# EAGLE schematic PotDivMUXwithOP v9 (EAGLE 9.7.0)
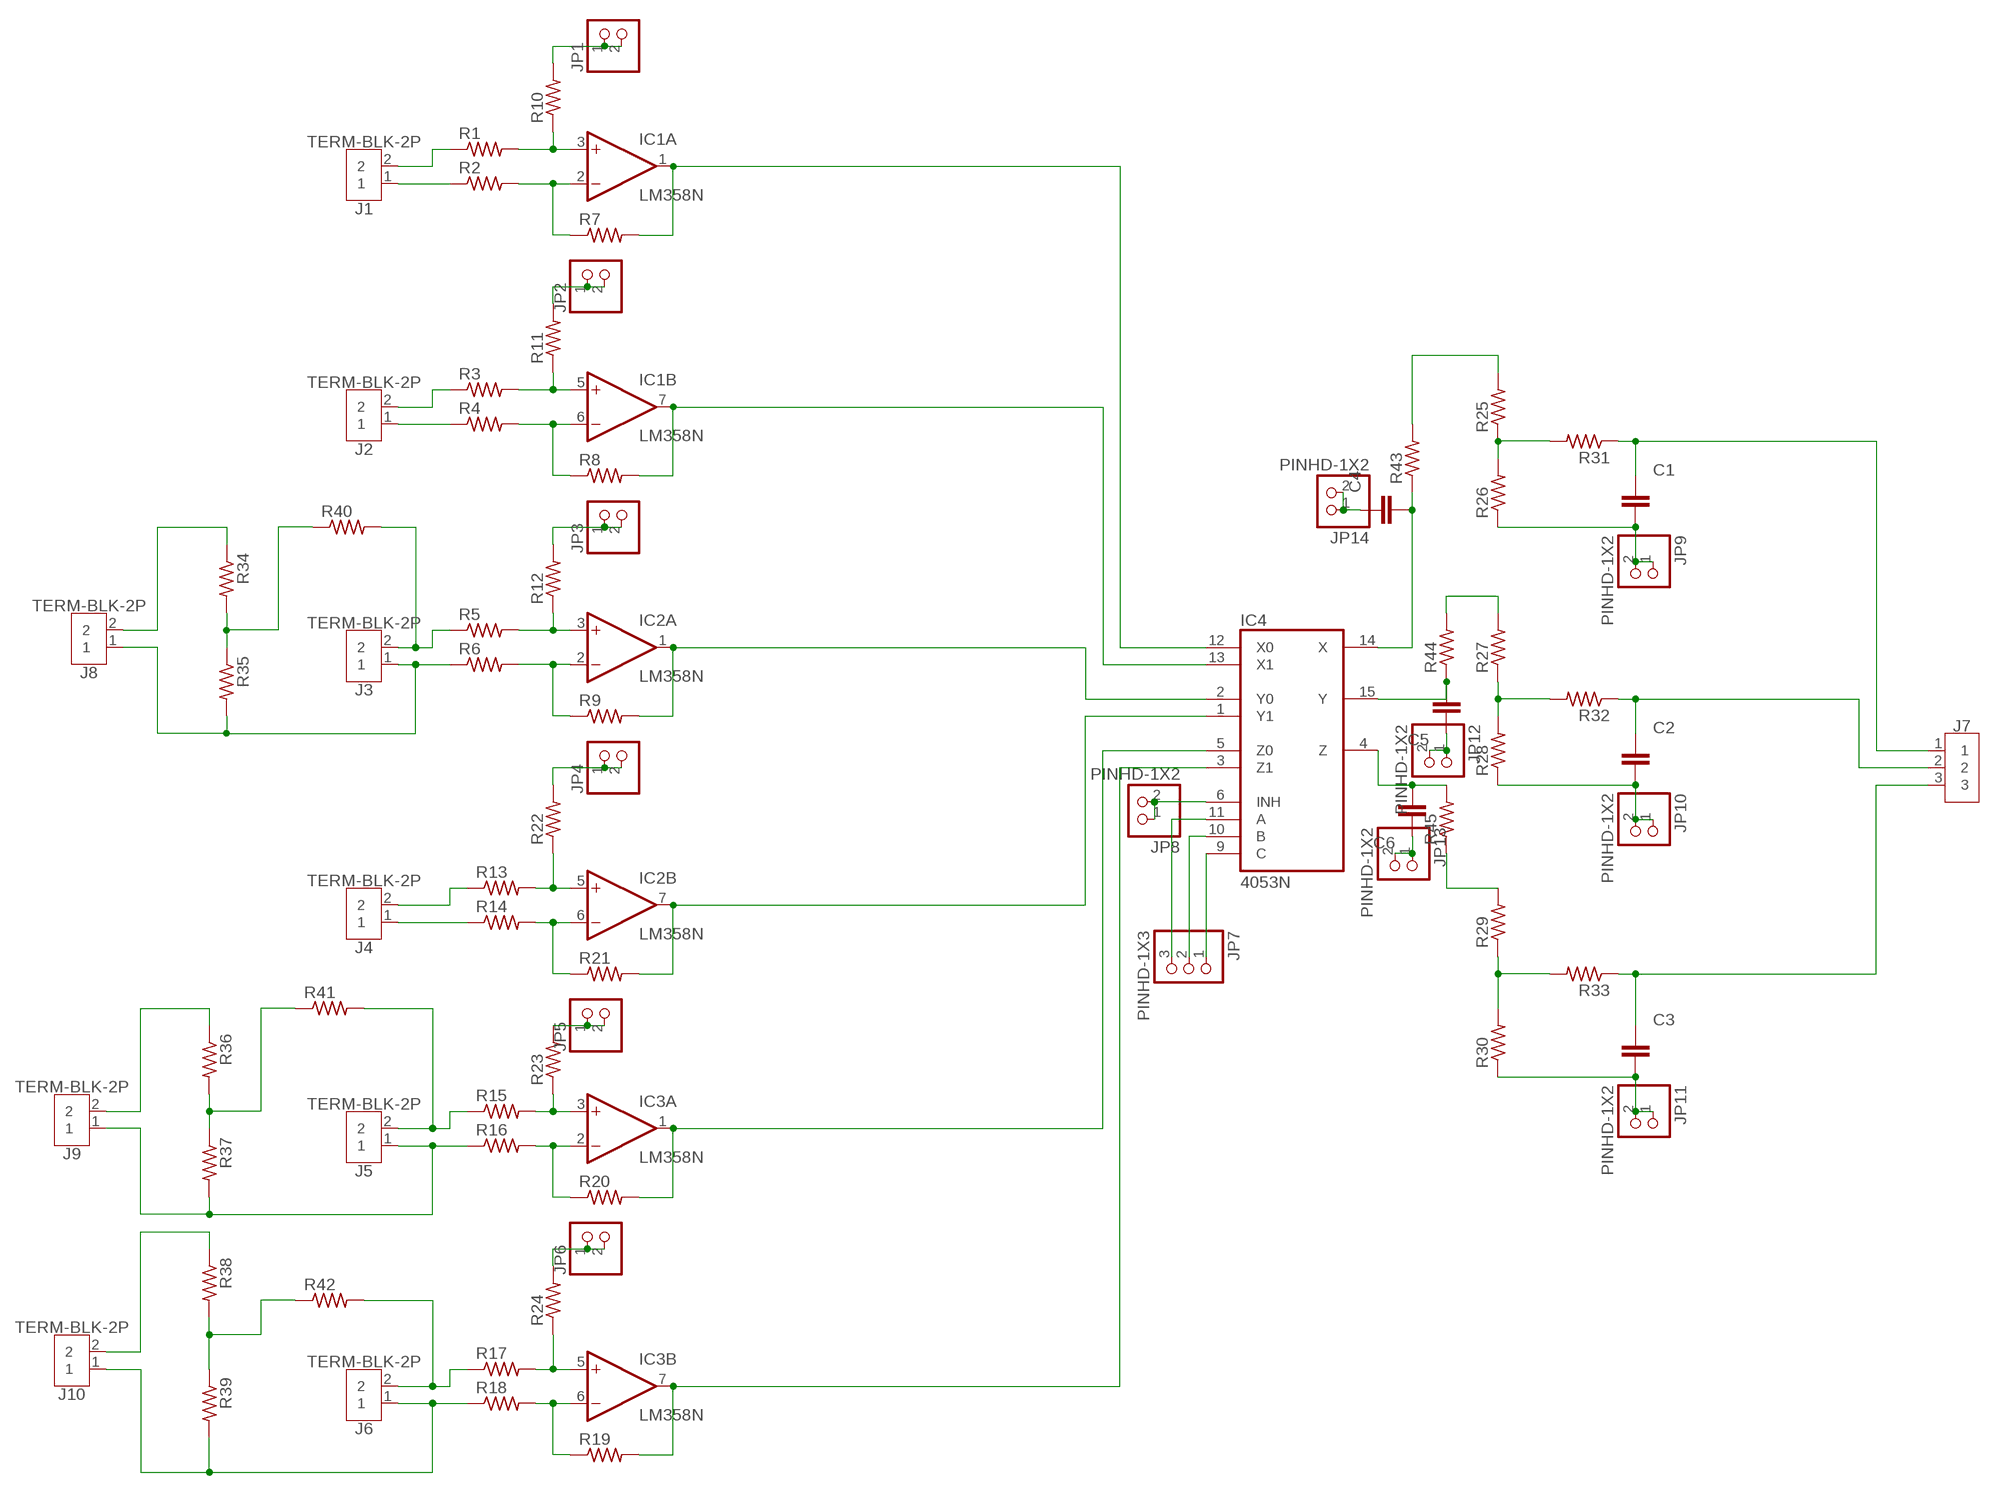
[diagram p0: schematic, sheet 1]

## Parts
C1  C_RADIAL-12.5MM-DIA  [CAPRD550W60D1025H1250B]
C2  C_RADIAL-12.5MM-DIA  [CAPRD550W60D1025H1250B]
C3  C_RADIAL-12.5MM-DIA  [CAPRD550W60D1025H1250B]
C4  C_RADIAL-12.5MM-DIA  [CAPRD550W60D1025H1250B]
C5  C_RADIAL-12.5MM-DIA  [CAPRD550W60D1025H1250B]
C6  C_RADIAL-12.5MM-DIA  [CAPRD550W60D1025H1250B]
IC1  LM358N  [DIL08]
IC2  LM358N  [DIL08]
IC3  LM358N  [DIL08]
IC4  4053N  [DIL16]
J1  TERM-BLK-2P  2828XX-2282837-2  [TERMBLK_508-2N]
J2  TERM-BLK-2P  2828XX-2282837-2  [TERMBLK_508-2N]
J3  TERM-BLK-2P  2828XX-2282837-2  [TERMBLK_508-2N]
J4  TERM-BLK-2P  2828XX-2282837-2  [TERMBLK_508-2N]
J5  TERM-BLK-2P  2828XX-2282837-2  [TERMBLK_508-2N]
J6  TERM-BLK-2P  2828XX-2282837-2  [TERMBLK_508-2N]
J7  TERM-BLK-3P  2828XX-3282837-3  [TERMBLK_508-3N]
J8  TERM-BLK-2P  2828XX-2282837-2  [TERMBLK_508-2N]
J9  TERM-BLK-2P  2828XX-2282837-2  [TERMBLK_508-2N]
J10  TERM-BLK-2P  2828XX-2282837-2  [TERMBLK_508-2N]
JP1  PINHD-1X2  [1X02]
JP2  PINHD-1X2  [1X02]
JP3  PINHD-1X2  [1X02]
JP4  PINHD-1X2  [1X02]
JP5  PINHD-1X2  [1X02]
JP6  PINHD-1X2  [1X02]
JP7  PINHD-1X3  [1X03]
JP8  PINHD-1X2  [1X02]
JP9  PINHD-1X2  [1X02]
JP10  PINHD-1X2  [1X02]
JP11  PINHD-1X2  [1X02]
JP12  PINHD-1X2  [1X02]
JP13  PINHD-1X2  [1X02]
JP14  PINHD-1X2  [1X02]
R1  R-US_AXIAL-7.2MM-PITCH  [RESAD724W46L381D178B]
R2  R-US_AXIAL-7.2MM-PITCH  [RESAD724W46L381D178B]
R3  R-US_AXIAL-7.2MM-PITCH  [RESAD724W46L381D178B]
R4  R-US_AXIAL-7.2MM-PITCH  [RESAD724W46L381D178B]
R5  R-US_AXIAL-7.2MM-PITCH  [RESAD724W46L381D178B]
R6  R-US_AXIAL-7.2MM-PITCH  [RESAD724W46L381D178B]
R7  R-US_AXIAL-7.2MM-PITCH  [RESAD724W46L381D178B]
R8  R-US_AXIAL-7.2MM-PITCH  [RESAD724W46L381D178B]
R9  R-US_AXIAL-7.2MM-PITCH  [RESAD724W46L381D178B]
R10  R-US_AXIAL-7.2MM-PITCH  [RESAD724W46L381D178B]
R11  R-US_AXIAL-7.2MM-PITCH  [RESAD724W46L381D178B]
R12  R-US_AXIAL-7.2MM-PITCH  [RESAD724W46L381D178B]
R13  R-US_AXIAL-7.2MM-PITCH  [RESAD724W46L381D178B]
R14  R-US_AXIAL-7.2MM-PITCH  [RESAD724W46L381D178B]
R15  R-US_AXIAL-7.2MM-PITCH  [RESAD724W46L381D178B]
R16  R-US_AXIAL-7.2MM-PITCH  [RESAD724W46L381D178B]
R17  R-US_AXIAL-7.2MM-PITCH  [RESAD724W46L381D178B]
R18  R-US_AXIAL-7.2MM-PITCH  [RESAD724W46L381D178B]
R19  R-US_AXIAL-7.2MM-PITCH  [RESAD724W46L381D178B]
R20  R-US_AXIAL-7.2MM-PITCH  [RESAD724W46L381D178B]
R21  R-US_AXIAL-7.2MM-PITCH  [RESAD724W46L381D178B]
R22  R-US_AXIAL-7.2MM-PITCH  [RESAD724W46L381D178B]
R23  R-US_AXIAL-7.2MM-PITCH  [RESAD724W46L381D178B]
R24  R-US_AXIAL-7.2MM-PITCH  [RESAD724W46L381D178B]
R25  R-US_AXIAL-7.2MM-PITCH  [RESAD724W46L381D178B]
R26  R-US_AXIAL-7.2MM-PITCH  [RESAD724W46L381D178B]
R27  R-US_AXIAL-7.2MM-PITCH  [RESAD724W46L381D178B]
R28  R-US_AXIAL-7.2MM-PITCH  [RESAD724W46L381D178B]
R29  R-US_AXIAL-7.2MM-PITCH  [RESAD724W46L381D178B]
R30  R-US_AXIAL-7.2MM-PITCH  [RESAD724W46L381D178B]
R31  R-US_AXIAL-7.2MM-PITCH  [RESAD724W46L381D178B]
R32  R-US_AXIAL-7.2MM-PITCH  [RESAD724W46L381D178B]
R33  R-US_AXIAL-7.2MM-PITCH  [RESAD724W46L381D178B]
R34  R-US_AXIAL-7.2MM-PITCH  [RESAD724W46L381D178B]
R35  R-US_AXIAL-7.2MM-PITCH  [RESAD724W46L381D178B]
R36  R-US_AXIAL-7.2MM-PITCH  [RESAD724W46L381D178B]
R37  R-US_AXIAL-7.2MM-PITCH  [RESAD724W46L381D178B]
R38  R-US_AXIAL-7.2MM-PITCH  [RESAD724W46L381D178B]
R39  R-US_AXIAL-7.2MM-PITCH  [RESAD724W46L381D178B]
R40  R-US_AXIAL-7.2MM-PITCH  [RESAD724W46L381D178B]
R41  R-US_AXIAL-7.2MM-PITCH  [RESAD724W46L381D178B]
R42  R-US_AXIAL-7.2MM-PITCH  [RESAD724W46L381D178B]
R43  R-US_AXIAL-7.2MM-PITCH  [RESAD724W46L381D178B]
R44  R-US_AXIAL-7.2MM-PITCH  [RESAD724W46L381D178B]
R45  R-US_AXIAL-7.2MM-PITCH  [RESAD724W46L381D178B]

## Nets
N$1: J1.1 R2.1
N$2: J1.2 R1.1
N$3: IC1.3(A:+IN) R1.2 R10.1
N$4: IC1.2(A:-IN) R2.2 R7.1
N$5: IC1.1(A:OUT) IC4.12(X0) R7.2
N$6: JP1.1 JP1.2 R10.2
N$7: J2.2 R3.1
N$8: J2.1 R4.1
N$9: IC1.5(B:+IN) R3.2 R11.1
N$10: IC1.6(B:-IN) R4.2 R8.1
N$11: JP2.1 JP2.2 R11.2
N$12: IC1.7(B:OUT) IC4.13(X1) R8.2
N$13: J3.1 J8.1 R6.1 R35.2
N$14: J3.2 R5.1 R40.2
N$15: IC2.3(A:+IN) R5.2 R12.1
N$16: JP3.1 JP3.2 R12.2
N$17: IC2.2(A:-IN) R6.2 R9.1
N$18: IC2.1(A:OUT) IC4.2(Y0) R9.2
N$19: J4.1 R14.1
N$20: J4.2 R13.1
N$21: IC2.5(B:+IN) R13.2 R22.1
N$22: IC2.6(B:-IN) R14.2 R21.1
N$23: JP4.1 JP4.2 R22.2
N$24: IC2.7(B:OUT) IC4.1(Y1) R21.2
N$25: J5.2 R15.1 R41.2
N$26: J5.1 J9.1 R16.1 R37.2
N$27: IC3.2(A:-IN) R16.2 R20.1
N$28: IC3.3(A:+IN) R15.2 R23.1
N$29: JP5.1 JP5.2 R23.2
N$30: IC3.1(A:OUT) IC4.5(Z0) R20.2
N$31: J6.1 J10.1 R18.1 R39.2
N$32: J6.2 R17.1 R42.2
N$33: IC3.5(B:+IN) R17.2 R24.1
N$34: JP6.1 JP6.2 R24.2
N$35: IC3.6(B:-IN) R18.2 R19.1
N$36: IC3.7(B:OUT) IC4.3(Z1) R19.2
N$37: IC4.6(INH) JP8.1 JP8.2
N$38: IC4.11(A) JP7.3
N$39: IC4.10(B) JP7.2
N$40: IC4.9(C) JP7.1
N$41: C4.2 IC4.14(X) R43.1
N$42: R25.1 R26.2 R31.2
N$43: C1.2 JP9.1 JP9.2 R26.1
N$44: C1.1 J7.1 R31.1
N$45: R27.2 R44.2
N$46: R27.1 R28.2 R32.2
N$47: C2.1 J7.2 R32.1
N$48: C2.2 JP10.1 JP10.2 R28.1
N$49: C6.2 IC4.4(Z) R45.2
N$50: R29.1 R30.2 R33.2
N$51: C3.2 JP11.1 JP11.2 R30.1
N$52: C3.1 J7.3 R33.1
N$53: R25.2 R43.2
N$54: J8.2 R34.1
N$55: R34.2 R35.1 R40.1
N$56: J9.2 R36.1
N$57: R36.2 R37.1 R41.1
N$58: C5.2 IC4.15(Y) R44.1
N$59: J10.2 R38.1
N$60: R29.2 R45.1
N$61: R38.2 R39.1 R42.1
N$62: C4.1 JP14.1 JP14.2
N$63: C5.1 JP12.1 JP12.2
N$64: C6.1 JP13.1 JP13.2

## Power pins joined to a net without a drawn wire
GND: IC4.8(GND)
V+: IC1.8(P:V+) IC2.8(P:V+) IC3.8(P:V+)
V-: IC1.4(P:V-) IC2.4(P:V-) IC3.4(P:V-)
VCC: IC4.16(VCC)
VEE: IC4.7(VEE)

## Library data of the parts
C1-C6 = Tutorial - Fusion 360:C: Capacitor - Generic; CATEGORY: Capacitor
IC1-IC3 = linear:LM358: OP AMP also LM158; LM258; LM2904 Source: http://cache.national.com/ds/LM/LM158.pdf
IC4 = 40xx:4053: Triple 2-channel ANALOG MULTIPLEXER
J1-J6 J8-J10 = Connector:2828XX-2: 2 Position Wire to Board Terminal Block Horizontal with Board Datasheet <https://www.te.com.cn/commerce/DocumentDelivery/DDEController?Action=showdoc&DocId=Catalog+Section%7F1308389_EUROSTYLE_TERMINAL_BLOCKS%7F0607%7Fpdf%7FEnglish%7FENG_CS_1308389_EUROSTYLE_TERMINAL_BLOCKS_0607.pdf%7F2-282837-5>; CATEGORY: Fixed Terminal Blocks; DESCRIPTION: Fixed Terminal Blocks 5.08MM PCB MOUNT 2P; MANUFACTURER: TE Connectivity AMP Connectors; MPN: 282837-2; OPERATING_TEMPERATURE: -40°C to +105°C; PART_STATUS: ACTIVE; PITCH: 0.200" (5.08mm); ROHS_COMPLIANCE: RoHS Compliant; SERIES: Buchanan; SUBCATEGORY: Terminal Blocks; TYPE: Through Hole; Screw - Rising Cage Clamp; Side wire entry, Horizontal with Board
J7 = Connector:2828XX-3: 3 Position Wire to Board Terminal Block Horizontal with Board Datasheet <https://www.te.com.cn/commerce/DocumentDelivery/DDEController?Action=showdoc&DocId=Catalog+Section%7F1308389_EUROSTYLE_TERMINAL_BLOCKS%7F0607%7Fpdf%7FEnglish%7FENG_CS_1308389_EUROSTYLE_TERMINAL_BLOCKS_0607.pdf%7F2-282837-5>; CATEGORY: Connector; DESCRIPTION: TERM BLK 3P SIDE ENT 5.08mm PCB; MANUFACTURER: TE Connectivity; MPN: 282837-3; OPERATING_TEMPERATURE: -40°C to +105°C; PART_STATUS: Active; PITCH: 0.200" (5.08mm); ROHS_COMPLIANCE: RoHS Compliant; SERIES: Buchanan; SUBCATEGORY: Terminal Block; TYPE: Side Wire Entry
JP1-JP6 = pinhead:PINHD-1X2: PIN HEADER
JP7 = Connector:PINHD-1X3: PIN HEADER; CATEGORY: Headers; DESCRIPTION: Header, Straight, 3 Position; MANUFACTURER: Generic; MPN: Generic; OPERATING_TEMPERATURE: Generic; PART_STATUS: Active; PITCH: 0.100" (2.54mm); ROHS_COMPLIANCE: Generic; SERIES: Generic; SUB-CATEGORY: Headers, Male Pins; TYPE: Board to Board or Cable, Unshrouded, Through Hole, Straight
JP8-JP14 = Connector:PINHD-1X2: PIN HEADER; CATEGORY: Headers; DESCRIPTION: Header, Straight, 2 Position; MANUFACTURER: Generic; MPN: Generic; OPERATING_TEMPERATURE: Generic; PART_STATUS: Active; PITCH: 0.100" (2.54mm); ROHS_COMPLIANCE: Generic; SERIES: Generic; SUB-CATEGORY: Headers, Male Pins; TYPE: Board to Board or Cable, Unshrouded, Through Hole, Straight
R1-R45 = Tutorial - Fusion 360:R-US: Resistor Fixed - ANSI; CATEGORY: Resistor; SUB-CATEGORY: Fixed